# EAGLE design Crimson_rev2 (EAGLE 9.4.0)
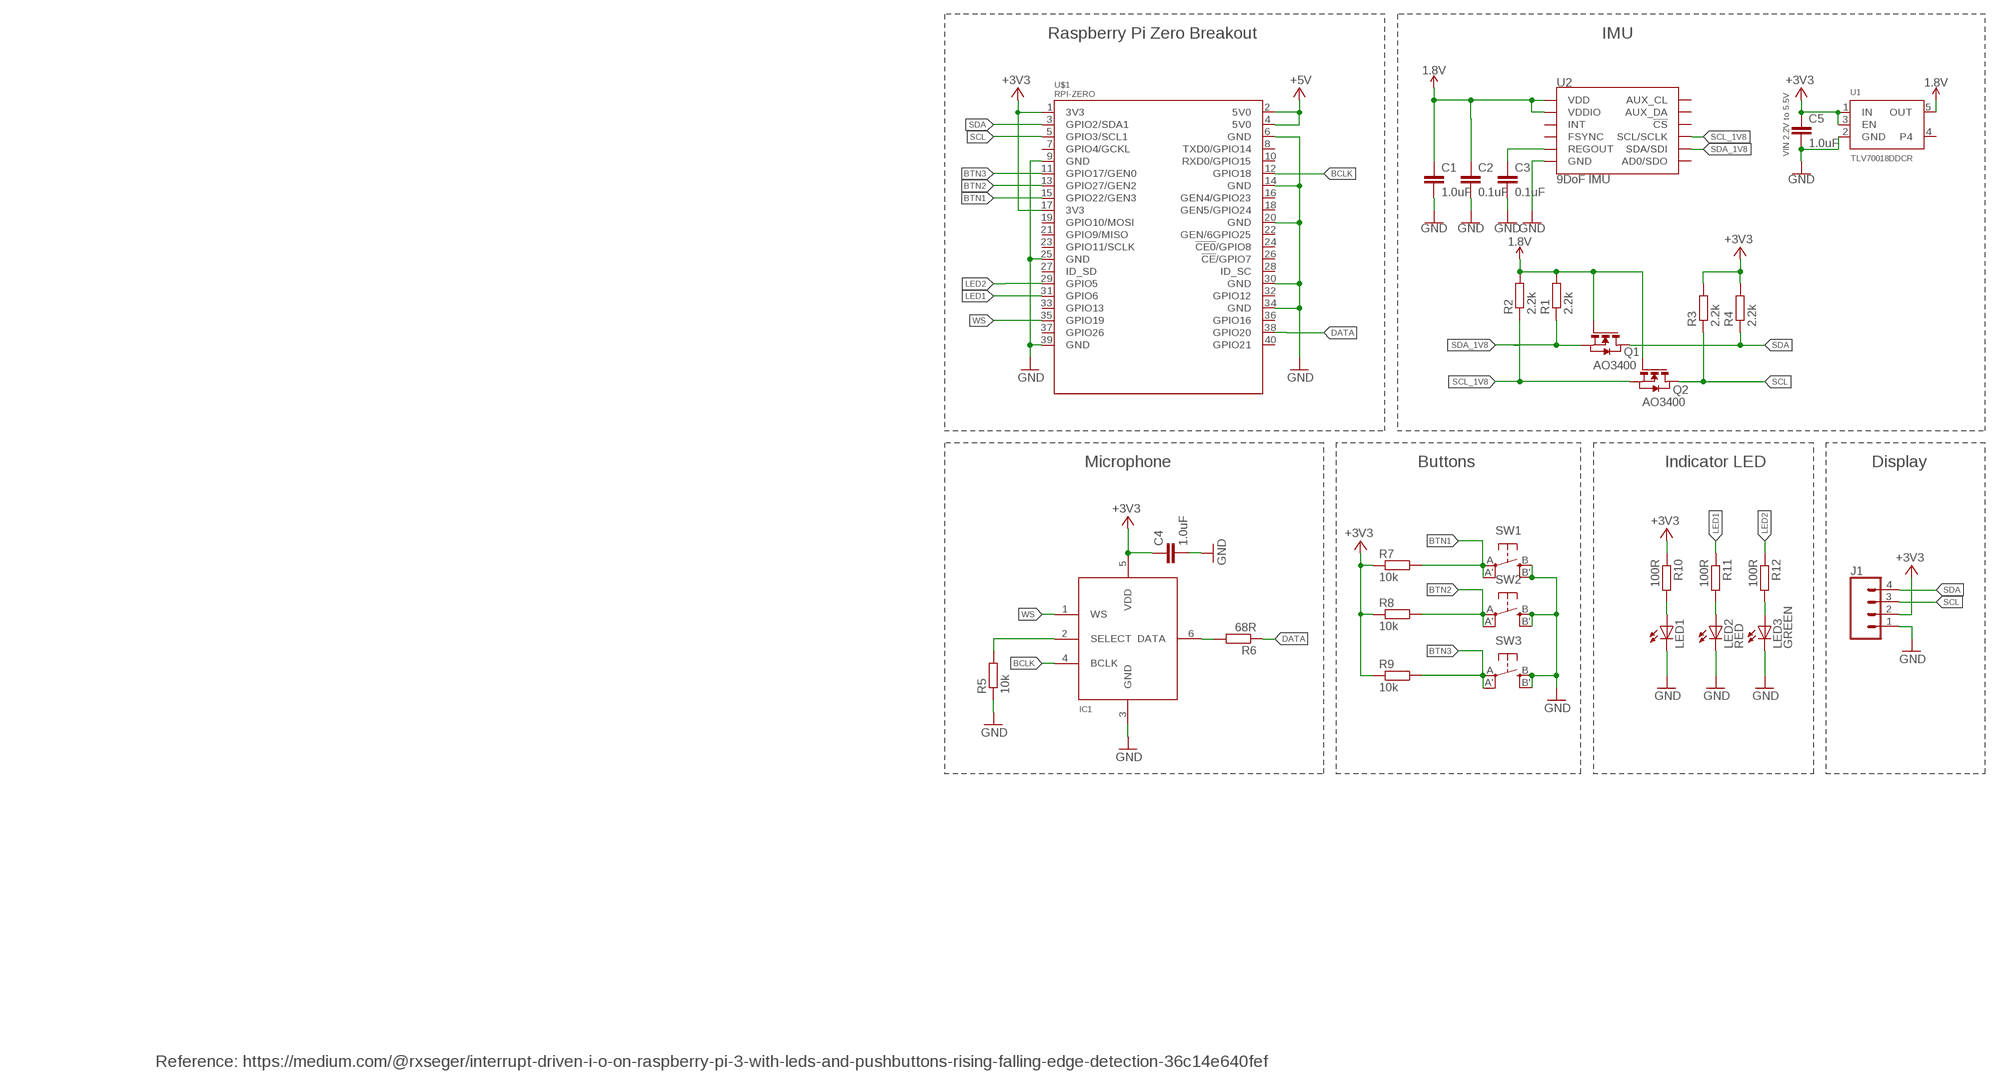
[diagram p0: schematic, sheet 1]

## Parts
C1  1.0uF  1.0UF-0402-16V-10%  [0402]
C2  0.1uF  0.1UF-0402-16V-10%  [0402]
C3  0.1uF  0.1UF-0402-16V-10%  [0402]
C4  1.0uF  1.0UF-0402-16V-10%  [0402]
C5  1.0uF  1.0UF-0402-16V-10%  [0402]
IC1  MIC_I2S_SPH0645  [SPH0645LM4H]
J1  CONN_04  [1X04]
LED1  LEDCHIPLED_0603  [CHIPLED_0603]
LED2  RED  LEDCHIPLED_0603  [CHIPLED_0603]
LED3  GREEN  LEDCHIPLED_0603  [CHIPLED_0603]
Q1  AO3400  NMOS-SOT23  [SOT-23]
Q2  AO3400  NMOS-SOT23  [SOT-23]
R1  2.2k  R-EU_R0402  [R0402]
R2  2.2k  R-EU_R0402  [R0402]
R3  2.2k  R-EU_R0402  [R0402]
R4  2.2k  R-EU_R0402  [R0402]
R5  10k  R-EU_R0402  [R0402]
R6  68R  R-EU_R0402  [R0402]
R7  10k  R-EU_R0402  [R0402]
R8  10k  R-EU_R0402  [R0402]
R9  10k  R-EU_R0402  [R0402]
R10  100R  R-EU_R0402  [R0402]
R11  100R  R-EU_R0402  [R0402]
R12  100R  R-EU_R0402  [R0402]
SW1  SPST_TACT-EVQQ2  [EVQ-Q2]
SW2  SPST_TACT-EVQQ2  [EVQ-Q2]
SW3  SPST_TACT-EVQQ2  [EVQ-Q2]
U1  TLV70018DDCR  MICROBUILDER_VREG_SOT23-5  [MICROBUILDER_SOT23-5]
U2  9DoF IMU  ICM-20948  [QFN24-3X3]
U$1  RPI-ZERO  [RASPBERRYPI_BASTELSTUBE_V13_RASPI_BOARD_B+_FULL]

## Nets
1.8V: C1.1 C2.1 Q1.G Q2.G R1.2 R2.2 U1.5(OUT) U2.8(VDDIO) U2.13(VDD)
+3V3: C4.1 C5.1 IC1.5(VDD) J1.2 R3.2 R4.2 R7.2 R8.2 R9.2 R10.1 U1.1(IN) U1.3(EN) U$1.1(3V3) U$1.17(3V3)
+5V: U$1.2(5V0) U$1.4(5V0)
BCLK: IC1.4(BCLK) U$1.12(GPIO18)
BTN1: R7.1 SW1.A'(P1) SW1.A(P) U$1.15(GPIO22/GEN3)
BTN2: R8.1 SW2.A'(P1) SW2.A(P) U$1.13(GPIO27/GEN2)
BTN3: R9.1 SW3.A'(P1) SW3.A(P) U$1.11(GPIO17/GEN0)
DATA: R6.1 U$1.38(GPIO20)
GND: C1.2 C2.2 C3.2 C4.2 C5.2 IC1.3(GND) J1.1 LED1.C LED2.C LED3.C R5.1 SW1.B'(S1) SW1.B(S) SW2.B'(S1) SW2.B(S) SW3.B'(S1) SW3.B(S) U1.2(GND) U2.18(GND) U2.20(GND) U$1.6(GND) U$1.9(GND) U$1.14(GND) U$1.20(GND) U$1.25(GND) U$1.30(GND) U$1.34(GND) U$1.39(GND)
LED1: R11.1 U$1.31(GPIO6)
LED2: R12.1 U$1.29(GPIO5)
N$1: C3.1 U2.10(REGOUT)
N$2: IC1.2(SELECT) R5.2
N$3: IC1.6(DATA) R6.2
N$4: LED1.A R10.2
N$6: LED2.A R11.2
N$7: LED3.A R12.2
SCL: J1.3 Q2.D R3.1 U$1.5(GPIO3/SCL1)
SCL_1V8: Q2.S R2.1 U2.23(SCL/SCLK)
SDA: J1.4 Q1.D R4.1 U$1.3(GPIO2/SDA1)
SDA_1V8: Q1.S R1.1 U2.24(SDA/SDI)
WS: IC1.1(WS) U$1.35(GPIO19)
Unconnected: U1.4 U2.7(AUX_CL) U2.9(AD0/SDO) U2.11(FSYNC) U2.12(INT) U2.21(AUX_DA) U2.22(!CS) U$1.7(GPIO4/GCKL) U$1.8(TXD0/GPIO14) U$1.10(RXD0/GPIO15) U$1.16(GEN4/GPIO23) U$1.18(GEN5/GPIO24) U$1.19(GPIO10/MOSI) U$1.21(GPIO9/MISO) U$1.22(GEN/6GPIO25) U$1.23(GPIO11/SCLK) U$1.24(!CE0!/GPIO8) U$1.26(!CE!/GPIO7) U$1.27(ID_SD) U$1.28(ID_SC) U$1.32(GPIO12) U$1.33(GPIO13) U$1.36(GPIO16) U$1.37(GPIO26) U$1.40(GPIO21)

## Notes on the sheet
- Raspberry Pi Zero Breakout | IMU
- VIN 2.2V to 5.5V
- Microphone | Buttons | Indicator LED | Display
- Reference: https://medium.com/@rxseger/interrupt-driven-i-o-on-raspberry-pi-3-with-leds-and-pushbuttons-rising-falling-edge-detection-36c14e640fef

## Library data of the parts
C1 C4 C5 = SparkFun-Capacitors:1.0UF: 1µF ceramic capacitors A capacitor is a passive two-terminal electrical component used to store electrical energy temporarily in an electric field.; PROD_ID: CAP-12417
C2 C3 = SparkFun-Capacitors:0.1UF: 0.1µF ceramic capacitors A capacitor is a passive two-terminal electrical component used to store electrical energy temporarily in an electric field.; PROD_ID: CAP-12416
IC1 = microbuilder:MIC_I2S
J1 = SparkFun-Connectors:CONN_04: Multi connection point. Often used as Generic Header-pin footprint for 0.1 inch spaced/style header connections On any of the 0.1 inch spaced packages, you can populate with these: Break Away Headers - Straight <https://www.sparkfun.com/products/116> (PRT-00116) Break Away Male Headers - Right Angle <https://www.sparkfun.com/products/553> (PRT-00553) Female Headers <https://www.sparkfun.com/products/115> (PRT-00115) Break Away Headers - Machine Pin <https://www.sparkfun.com/products/117> (PRT-00117) Break Away Female Headers - Swiss Machine Pin <https://www.sparkfun.com/products/743> (PRT-00743) For SCREWTERMINALS and SPRING TERMINALS visit here: Screw Terimnals on SparkFun.com <https://www.sparkfun.com/search/results?term=Screw+Terminals> (5mm/3.5mm/2.54mm spacing) This device is also useful as a general connection point to wire up your design to another part of your project. Our various solder wires solder well into these plated through hole pads. Hook-Up Wire - Assortment (Stranded, 22 AWG) <https://www.sparkfun.com/products/11375> (PRT-11375) Hook-Up Wire - Assortment (Solid Core, 22 AWG) <https://www.sparkfun.com/products/11367> (PRT-11367) View the entire wire category on our website here <https://www.sparkfun.com/categories/141> Special notes: Molex polarized connector foot print use with SKU : PRT-08231 with associated crimp pins and housings. 1MM SMD Version SKU: PRT-10208; PROD_ID: CONN-09696
LED1-LED3 = adafruit:LED: LED OSRAM: - CHIPLED LG R971, LG N971, LY N971, LG Q971, LY Q971, LO R971, LY R971 LH N974, LH R974 LS Q976, LO Q976, LY Q976 LO Q996 - Hyper CHIPLED LW Q18S LB Q993, LB Q99A, LB R99A - SideLED LS A670, LO A670, LY A670, LG A670, LP A670 LB A673, LV A673, LT A673, LW A673 LH A674 LY A675 LS A676, LA A676, LO A676, LY A676, LW A676 LS A679, LY A679, LG A679 - Hyper Micro SIDELED® LS Y876, LA Y876, LO Y876, LY Y876 LT Y87S - SmartLED LW L88C, LW L88S LB L89C, LB L89S, LG L890 LS L89K, LO L89K, LY L89K LS L896, LA L896, LO L896, LY L896 - TOPLED LS T670, LO T670, LY T670, LG T670, LP T670 LSG T670, LSP T670, LSY T670, LOP T670, LYG T670 LG T671, LOG T671, LSG T671 LB T673, LV T673, LT T673, LW T673 LH T674 LS T676, LA T676, LO T676, LY T676, LB T676, LH T676, LSB T676, LW T676 LB T67C, LV T67C, LT T67C, LS T67K, LO T67K, LY T67K, LW E67C LS E67B, LA E67B, LO E67B, LY E67B, LB E67C, LV E67C, LT E67C LW T67C LS T679, LY T679, LG T679 LS T770, LO T770, LY T770, LG T770, LP T770 LB T773, LV T773, LT T773, LW T773 LH T774 LS E675, LA E675, LY E675, LS T675 LS T776, LA T776, LO T776, LY T776, LB T776 LHGB T686 LT T68C, LB T68C - Hyper Mini TOPLED® LB M676 - Mini TOPLED Santana® LG M470 LS M47K, LO M47K, LY M47K Source: http://www.osram.convergy.de/
Q1 Q2 = MOSFET:NMOS: N-Channel MOSFET
R1-R12 = rcl:R-EU_: RESISTOR, European symbol; SPICEPREFIX: R
SW1-SW3 = adafruit:SPST_TACT: SMT 6mm switch, EVQQ2 series http://www.ladyada.net/library/eagle
U1 = Adafruit ESP8266 Feather rev E:MICROBUILDER_VREG_SOT23-5: SOT23-5 Fixed Voltage Regulators Part Current Out V Out V In V Dropout θJA (°C/W) TJ (°C) Digikey Part No. ADP121 150mA 3.3V 3.4-5.5V 0.09V @ 150mA -- -- ADP121-AUJZ33R7CT-ND ADP121 150mA 3.0V 3.1-5.5V 0.09V @ 150mA -- -- ADP121-AUJZ30R7CT-ND ADP122 300mA 3.3V 3.4-5.5V 0.085V @ 300mA -- -- ADP122AUJZ-3.3-R7CT-ND ADP1712 300mA 3.3V 3.5-5.5V 0.17V @ 300mA -- -- ADP1712AUJZ-3.3-R7TR-ND AP7311 (Low Cost) 150mA 3.3V 3.5-6V 0.15V @ 150mA -- -- AP7311-33WG-7DICT-ND LD39015M18R 150mA 1.8V 1.9V-5.5V 0.08V @ 100mA -- -- 497-6977-1-ND LP2985A-33DBVR 150mA 3.3V 3.3-16V 0.28V @ 150mA 206 150 296-18479-1-ND MCP1824T-3302E/OT 300mA 3.3V 3.5V-6V 0.2V @ 300mA -- -- MCP1824T-3302E/OTCT-ND MIC5205-2.5YM5 TR 150mA 2.5V 2.7-16V 0.165V @ 150mA -- -- 576-1257-2-ND MIC5205-3.0YM5 TR 150mA 3.0V 3.2V-16V 0.165V @ 150mA -- -- 576-1258-2-ND MIC5205-3.3YM5 TR 150mA 3.3V 3.5V-16V 0.165V @ 150mA -- -- 576-1259-2-ND TPS780330220 150mA 3.3V+2.2V 3.6-5.5V 250mV Max -- -- 296-23332-1-ND TDA3663/N1,135 100mA 3.3V 3.5-45V 0.18V @ 50mA -- -- 568-5343-1-ND Max operating temp can be calculated using θJA, TJ (max junction temperature), and power in watts. Set the "Maximum Ambient Temperature" until it reaches TJ ("Max Junction Temperature"), which is the absolute limit for safe use of the regulator: Heat Sink Temperature Calculator <http://www.daycounter.com/Calculators/Heat-Sink-Temperature-Calculator.phtml> For example, With 12V source into a 3.3V LP2985 and a 30mA load, we are dissipating (12V-3.3V) * 0.03A = 0.261W. With a θJA of 206 °C/W, a TJ of 150°C, and 261mW we can safely use the chip without a heat sink up to 75°C (=147.1°C Junction Temperature).
U2 = SparkFun-Sensors:ICM-20948: ICM-20948 9 Degree of Freedom IMU World’s lowest power 9-axis MotionTracking device that is ideally suited for smartphones, tablets, wearable sensors, and IoT applications. Includes onboard Digital Motion Processor to offload computations from the host processor Datasheet <https://cdn.sparkfun.com/assets/learn_tutorials/5/5/0/MPU9250REV1.0.pdf> SparkFun Products: SparkFun IMU Breakout - ICM-20948 <https://www.sparkfun.com/products/15182>; PROD_ID: IC-14247
U$1 = RPI-Zero:RPI-ZERO

## Board
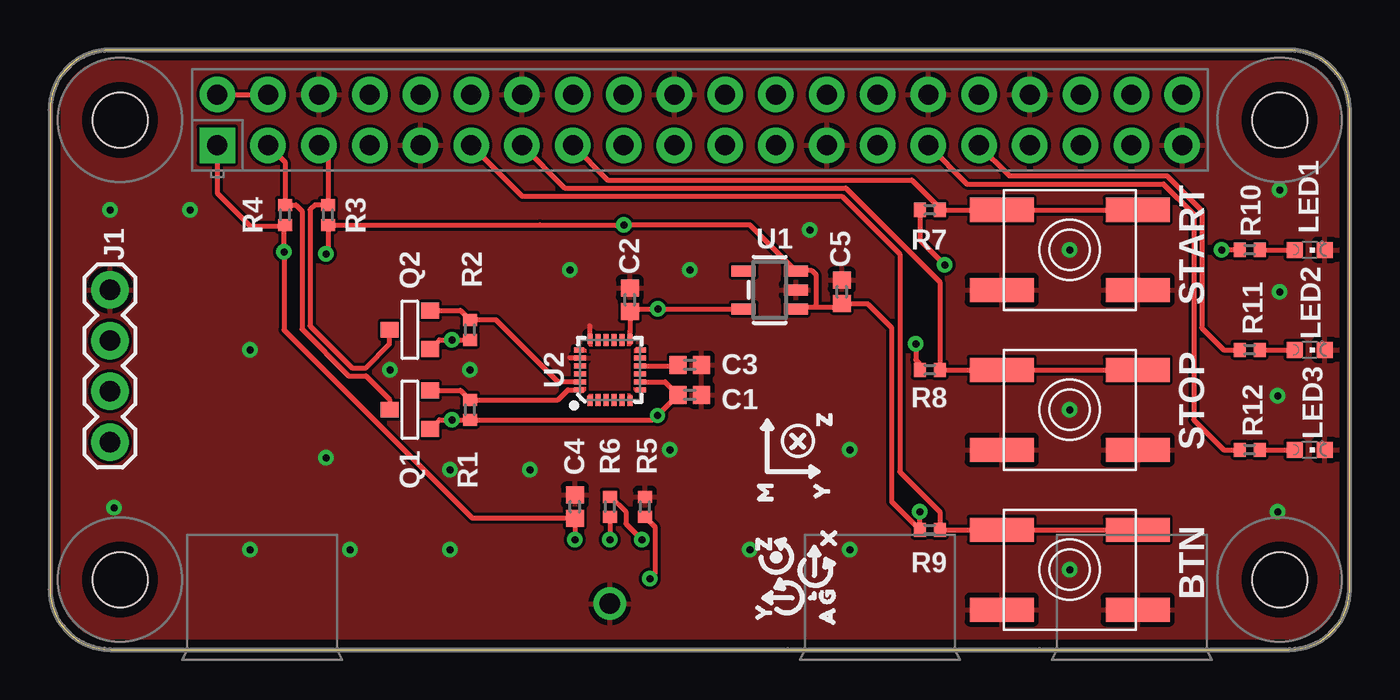
[diagram p1: board, top side]
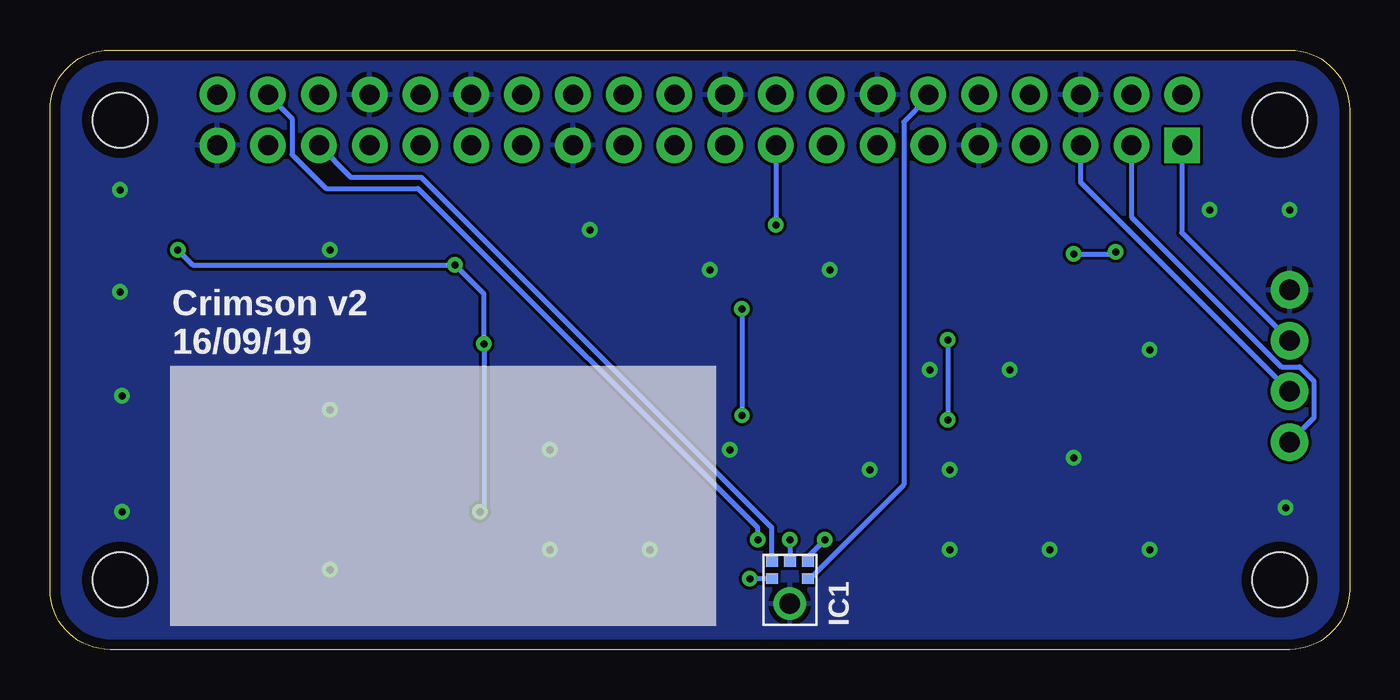
[diagram p2: board, bottom side, seen from below]

Size 65 x 30 mm. Coordinates in mm from the lower left corner, seen from the top.
Outline: 3,0 62,0 arc90 65,3 65,27 arc90 62,30 3,30 arc90 0,27 0,3 arc90 3,0
Copper layers (1*16): Top 0.035mm / dielectric 1.5mm / Bottom 0.035mm
Design rules "default": minimum track width 6mil, minimum drill 0.35mm, track to track 6mil, track to pad 6mil, pad to pad 6mil, via to via 6mil, smd to smd 6mil, copper to edge 20mil, drill to drill 6mil, minimum pad ring 10mil, minimum via ring 8mil, stop-mask expansion 4mil, vias tented up to drill 0.4mm, thermal gap 10mil

### Footprints (pad centres in the part's own frame; a part is rotated, then mirrored left to right if it is on the bottom)
0402 = smd 0.85 x 0.9: 1 -0.58,0; 2 0.58,0
SPH0645LM4H = smd 0.6 x 0.525: 1 -0.9,1.4; 2 -0.9,0.55; 4 0.9,0.55; 5 0.9,1.4; 6 0,1.4 | drill 1.025 pad 1.625: 3 0,-0.71
1X04 = drill 1.016 pad 1.88: 1 0,0; 2 2.54,0; 3 5.08,0; 4 7.62,0
CHIPLED_0603 = smd 0.8 x 0.8: A 0,-0.75; C 0,0.75
SOT-23 = smd 0.787 x 0.889: D 0,1.016; G -0.965,-1.016; S 0.965,-1.016
R0402 = smd 0.6 x 0.7: 1 -0.5,0; 2 0.5,0
EVQ-Q2 = smd 3.2 x 1.2: A -3.4,-2; A' 3.4,-2; B -3.4,2; B' 3.4,2
MICROBUILDER_SOT23-5 = smd 0.55 x 1.2: 1 -0.95,-1.3; 2 0,-1.3; 3 0.95,-1.3; 4 0.95,1.3; 5 -0.95,1.3
QFN24-3X3 = smd 0.495 x 0.25: 1 -1.552,1; 6 -1.552,-1; 13 1.552,-1; 18 1.552,1 | smd 0.6 x 0.25: 2 -1.5,0.6; 3 -1.5,0.2; 4 -1.5,-0.2; 5 -1.5,-0.6; 14 1.5,-0.6; 15 1.5,-0.2; 16 1.5,0.2; 17 1.5,0.6 | smd 0.25 x 0.495: 7 -1,-1.552; 12 1,-1.552; 19 1,1.552; 24 -1,1.552 | smd 0.25 x 0.6: 8 -0.6,-1.5; 9 -0.2,-1.5; 10 0.2,-1.5; 11 0.6,-1.5; 20 0.6,1.5; 21 0.2,1.5; 22 -0.2,1.5; 23 -0.6,1.5
RASPBERRYPI_BASTELSTUBE_V13_RASPI_BOARD_B+_FULL = drill 1 pad 1.778 square: 1 8.37,25.23 | drill 1 pad 1.778: 2 8.37,27.77; 3 10.91,25.23; 4 10.91,27.77; 5 13.45,25.23; 6 13.45,27.77; 7 15.99,25.23; 8 15.99,27.77; 9 18.53,25.23; 10 18.53,27.77; 11 21.07,25.23; 12 21.07,27.77; 13 23.61,25.23; 14 23.61,27.77; 15 26.15,25.23; 16 26.15,27.77; 17 28.69,25.23; 18 28.69,27.77; 19 31.23,25.23; 20 31.23,27.77; 21 33.77,25.23; 22 33.77,27.77; 23 36.31,25.23; 24 36.31,27.77; 25 38.85,25.23; 26 38.85,27.77; 27 41.39,25.23; 28 41.39,27.77; 29 43.93,25.23; 30 43.93,27.77; 31 46.47,25.23; 32 46.47,27.77; 33 49.01,25.23; 34 49.01,27.77; 35 51.55,25.23; 36 51.55,27.77; 37 54.09,25.23; 38 54.09,27.77; 39 56.63,25.23; 40 56.63,27.77 | hole 2.75: 3.5,3.5; 3.5,26.5; 61.5,3.5; 61.5,26.5

### Placement (x,y rotation side)
C1  32,12.75 0 top
C2  29,17.5 90 top
C3  32,14.25 0 top
C4  26.25,7.15 90 top
C5  39.6,17.9 90 top
IC1  28,3 0 bottom
J1  3,18 270 top
LED1  63,20 270 top
LED2  63,15 270 top
LED3  63,10 270 top
Q1  18,12 90 top
Q2  18,16 90 top
R1  21,12 270 top
R2  21,16 270 top
R3  13.9,21.75 270 top
R4  11.75,21.75 270 top
R5  29.75,7.15 270 top
R6  28,7.15 270 top
R7  44,22 180 top
R8  44,14 180 top
R9  44,6 180 top
R10  60,20 0 top
R11  60,15 0 top
R12  60,10 0 top
SW1  51,20 180 top
SW2  51,12 180 top
SW3  51,4 180 top
U1  36,18 90 top
U2  28,14 90 top
U$1  0,0 0 top
U$34  [X0]  38.94,4.49 90 top
U$35  [Y1]  35.69,0.81 90 top
U$36  [Z2]  35.69,4.24 90 top
U$37  [G5]  38.87,1.57 90 top
U$38  [A4]  38.87,0.55 90 top
U$39  [M3]  35.77,6.7 90 top
U$41  [Y1]  38.61,6.88 90 top
U$42  [Z2]  38.74,12.53 270 top

### Tracks (layer width: path | path; a pad name or v marks a point on that pad's centre or on a via)
1.8V  (via drill 0.35)
  Top 0.254: Q2.G 19.48,15.5 v20.1,15.5 R2.2 | Q1.G 19.48,11.5 v20.1,11.5 R1.2 30.17,11.5 v30.39,11.71 C1.1 30.77,13.4 U2.8 | 29,15.92 C2.1 29.13,17.05 v30.4,17.05 U1.5 | 29,15.92 | 29,15.85 29,15.92 | 29,15.92 | 29,15.92 29,15.85 | 29,15.92 | 29,15.92 29,15.85 | 29,15.92 | 29,15.92 29,15.85 | U2.13 29,15.91 29,15.92
  Bottom 0.254: v20.1,15.5 v20.1,11.5 | v30.4,17.05 30.4,11.73 v30.39,11.71
+3V3  (via drill 0.35)
  Top 0.254: U$1.1 8.37,22.83 10,21.2 11.7,21.2 | 11.7,21.2 R4.2 | v13.8,19.8 13.9,19.9 R3.2 24.5,21.25 v28.7,21.25 35,21.25 U1.3 37.6,18.95 38.12,18.95 38.3,18.77 38.3,17.22 38.3,17.12 | 11.7,21.2 v11.7,19.9 11.7,20.1 11.7,16 21.13,6.57 C4.1 v26.25,5.5 | C5.1 | C5.1 39.4,17.12 38.3,17.12 | 38.3,17.12 37.37,17.12 U1.1 | C5.1 39.6,17.3 40.9,17.3 42.09,16.11 42.09,7.41 R9.2 v43.5,6.9 | v43.3,15.3 43.3,14.5 43.5,14.3 R8.2 | R7.2 43.5,20.5 v44.75,19.25 | R10.1 v58.6,20
  Bottom 0.254: J1.2 8.4,20.86 8.4,25.2 U$1.1 | v13.8,19.8 11.8,19.8 v11.7,19.9 | v26.25,5.5 27.1,4.65 IC1.5 | U$1.17 v28.7,21.25 | v43.5,6.9 43.4,7 43.3,7.1 v43.3,15.3 43.3,17.8 v44.75,19.25 57.85,19.25 v58.6,20
+5V
  Top 0.254: U$1.2 U$1.4
BCLK
  Bottom 0.254: IC1.4 26.99,3.55 22.3,8.24 22.3,26.4 21.07,27.63 U$1.12
BTN1
  Top 0.254: R7.1 44.6,22 | 44.6,22 SW1.A' SW1.A | U$1.15 27.88,23.5 43.1,23.5 44.6,22
BTN2
  Top 0.254: SW2.A SW2.A' R8.1 44.5,18.4 39.81,23.09 25.75,23.09 U$1.13
BTN3
  Top 0.254: SW3.A SW3.A' R9.1 44.5,6.9 42.5,8.9 42.5,19.79 39.6,22.69 23.61,22.69 U$1.11
DATA  (via drill 0.35)
  Top 0.254: R6.1 28.05,7.65 28.8,6.89 28.8,6.3 v29.6,5.5
  Bottom 0.254: U$1.38 52.89,26.57 52.89,24.77 51.19,23.07 46.59,23.07 29.6,6.08 v29.6,5.5
GND  (via drill 0.35)
  Top 0.254: U2.18 27,16.2 | U2.20 26,14.6
  other vias: 10,5 15,5 13.8,9.6 10,15 20,5 35,5 40,5 40,10 3,22 7,22 26,19 21,14 17,14 20,9 24,9 31,10 32,19 38,21 51,20 51,12 51,4 61.5,23 61.5,17.9 61.4,12.7 61.4,6.9 3.2,7.1
  pour Top: 0,30 65,30 65,0 0,0
  pour Bottom: 0,30 65,30 65,0 0,0
LED1
  Top 0.254: U$1.31 46.47,25.22 47.98,23.71 55.86,23.71 57.61,21.96 57.61,16.1 58.71,15 R11.1
LED2
  Top 0.254: U$1.29 45.86,23.3 55.7,23.3 57.2,21.8 57.2,11.5 58.7,10 R12.1
N$1
  Top 0.254: C3.1 31.42,14.2 31.4,14.17 29.53,14.17 U2.10
N$2  (via drill 0.35)
  Top 0.254: v30,3.55 30.25,3.8 30.25,6.15 R5.2
  Bottom 0.254: IC1.2 v30,3.55
N$3  (via drill 0.35)
  Top 0.254: R6.2 v28,5.5
  Bottom 0.254: v28,5.5 IC1.6
N$4
  Top 0.254: R10.2 LED1.A
N$6
  Top 0.254: R11.2 LED2.A
N$7
  Top 0.254: R12.2 LED3.A
SCL
  Top 0.254: U$1.5 13.9,24.78 R3.1 13.25,22.25 13.01,22.01 13.01,16.19 15.1,14.1 15.8,14.1 16.98,15.28 Q2.D
  Bottom 0.254: J1.3 13.45,23.37 U$1.5
SCL_1V8
  Top 0.254: Q2.S 20.54,16.96 R2.1 22.3,16.5 25.4,13.4 U2.23
SDA
  Top 0.254: U$1.3 11.75,24.39 R4.1 12.3,22.25 12.6,21.95 12.6,16.02 14.93,13.69 15.8,13.69 16.98,12.51 Q1.D
  Bottom 0.254: U$1.3 10.91,21.65 3.4,14.14 2.5,14.14 1.78,13.43 1.78,11.6 J1.4
SDA_1V8
  Top 0.254: Q1.S 20.54,12.96 R1.1 25.4,12.5 25.9,13 U2.24
WS
  Bottom 0.254: U$1.35 49.95,23.63 46.43,23.63 28.9,6.1 IC1.1

### Text on the board
tPlace: START | STOP | BTN
bPlace: Crimson v2 / 16/09/19